# Altium schematic sheet MiniSCT-LB-DUT.SchDoc: Title-Name
size A4; Organization: Test-Engineering; Address1: Hans-Bunte-Strasse 19; Address2: D-79108 Freiburg; Address3: Germany; DocumentNumber: Document Nr.; SheetNumber: 1; SheetTotal: 1; Date: Date Engineer; CheckedBy: Reviewer; CompanyName: TDK-Micronas GmbH; DrawnBy: Draftsman; Engineer: Engineer; PageSetup: Record=PageOptions|CenterHorizontal=True|CenterVertical=True|PrintScale=0.97|XCorrection=1.00|YCorrection=1.00|PrintKind=0|BorderSize=5000000|LeftOffset=0|BottomOffset=0|Orientation=2|PaperLength=1000|PaperWidth=1000|Scale=100|PaperSource=7|PrintQuality=-3|MediaType=1|DitherType=10|PrintScaleMode=1|PaperKind=A4|PaperIndex=9
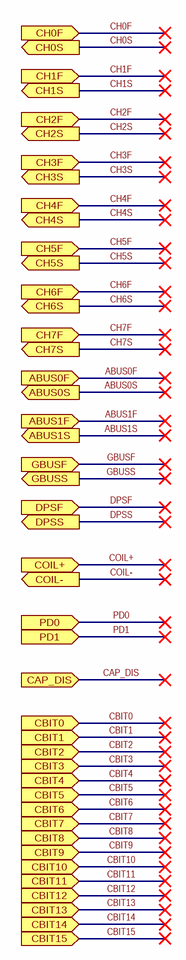
[diagram p0: MiniSCT-LB-DUT.SchDoc]

## Ports
ABUS0F (in), ABUS0S (out), ABUS1F (in), ABUS1S (out), CAP_DIS (in), CBIT0 (in), CBIT1 (in), CBIT2 (in), CBIT3 (in), CBIT4 (in), CBIT5 (in), CBIT6 (in), CBIT7 (in), CBIT8 (in), CBIT9 (in), CBIT10 (in), CBIT11 (in), CBIT12 (in), CBIT13 (in), CBIT14 (in), CBIT15 (in), CH0F (in), CH0S (out), CH1F (in), CH1S (out), CH2F (in), CH2S (out), CH3F (in), CH3S (out), CH4F (in), CH4S (out), CH5F (in), CH5S (out), CH6F (in), CH6S (out), CH7F (in), CH7S (out), COIL+ (in), COIL- (out), DPSF (in), DPSS (out), GBUSF (in), GBUSS (out), PD0 (in), PD1 (in)

## Nets
ABUS0F: port ABUS0F
ABUS0S: port ABUS0S
ABUS1F: port ABUS1F
ABUS1S: port ABUS1S
CAP_DIS: port CAP_DIS
CBIT0: port CBIT0
CBIT1: port CBIT1
CBIT2: port CBIT2
CBIT3: port CBIT3
CBIT4: port CBIT4
CBIT5: port CBIT5
CBIT6: port CBIT6
CBIT7: port CBIT7
CBIT8: port CBIT8
CBIT9: port CBIT9
CBIT10: port CBIT10
CBIT11: port CBIT11
CBIT12: port CBIT12
CBIT13: port CBIT13
CBIT14: port CBIT14
CBIT15: port CBIT15
CH0F: port CH0F
CH0S: port CH0S
CH1F: port CH1F
CH1S: port CH1S
CH2F: port CH2F
CH2S: port CH2S
CH3F: port CH3F
CH3S: port CH3S
CH4F: port CH4F
CH4S: port CH4S
CH5F: port CH5F
CH5S: port CH5S
CH6F: port CH6F
CH6S: port CH6S
CH7F: port CH7F
CH7S: port CH7S
COIL+: port COIL+
COIL-: port COIL-
DPSF: port DPSF
DPSS: port DPSS
GBUSF: port GBUSF
GBUSS: port GBUSS
PD0: port PD0
PD1: port PD1

## Notes on the sheet
- Designed by
- Reviewed by
- Drawn by
- Semi-ATE Ltd.
- Altium Rev.:
- Project:
- Variant:
- Bulgaria
- 3400, Montana
- Ivan Vazov 8, Str.
- File:
- Revision
- Sheets
- of
- A4